# Altium schematic sheet ACT_REG.SchDoc
size A; SheetNumber: 5; SheetTotal: 5
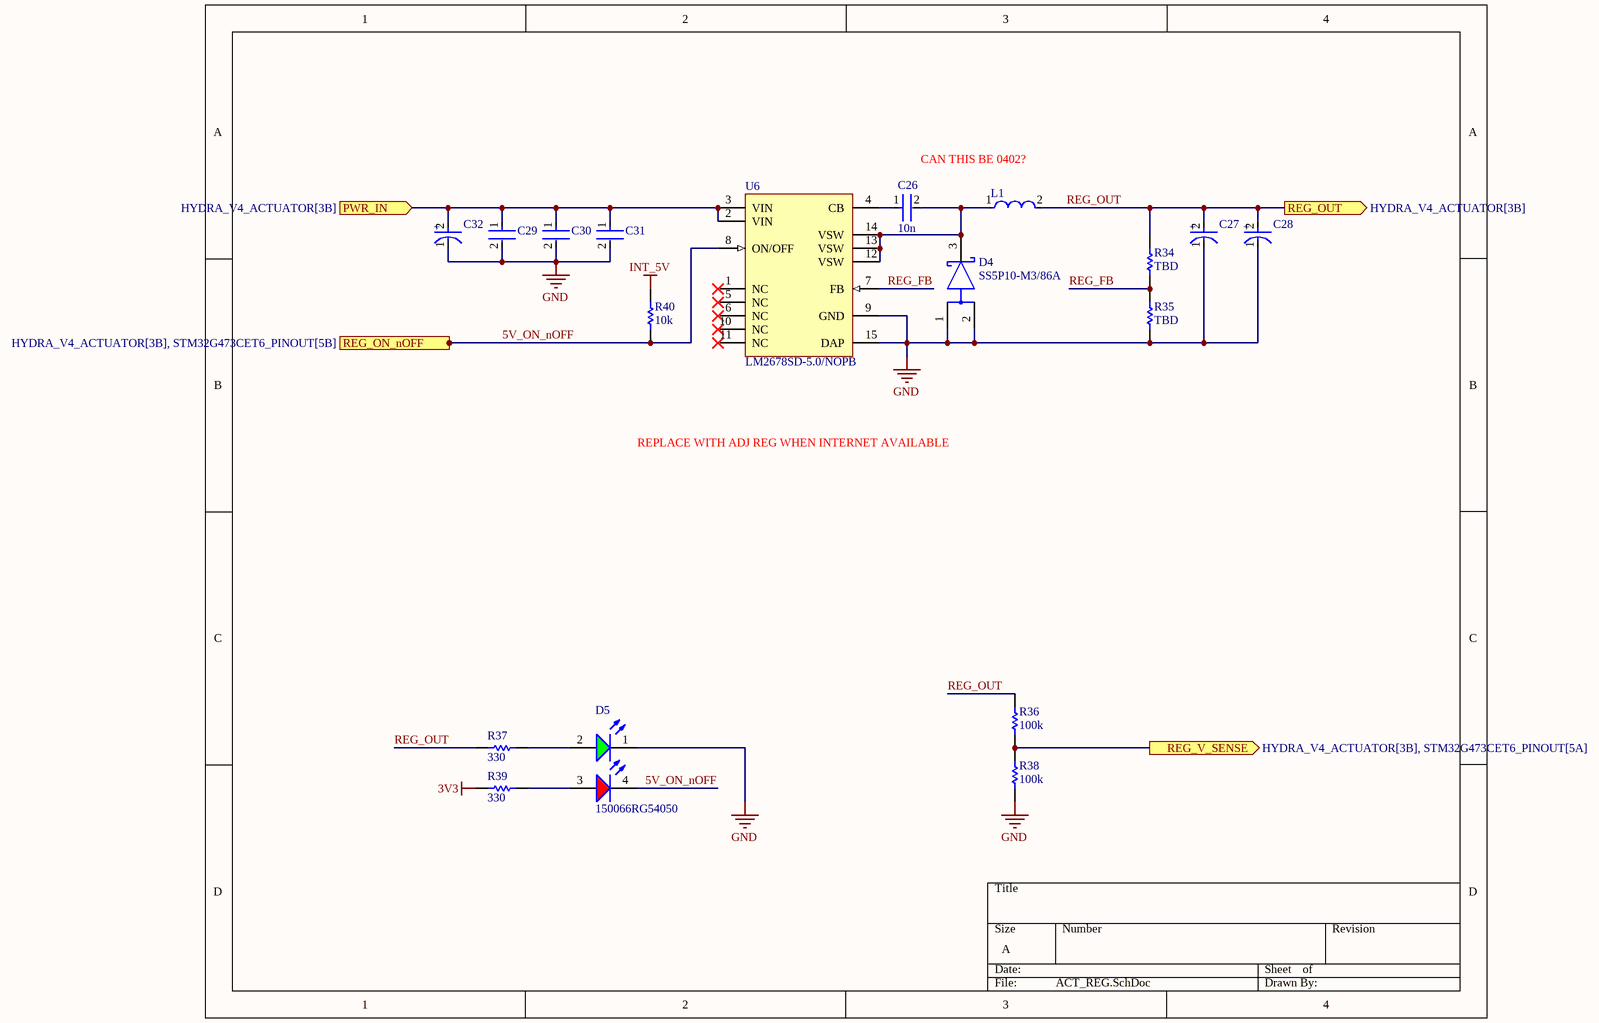
[diagram p0: ACT_REG.SchDoc]

## Parts
C26  10n  [FP-0402-L_1_0_0_05-W_0_5-IPC_A]
C27  10TPC68M  [FP-POSCAP-D2-MFG]  (value not drawn)
C28  10TPC68M  [FP-POSCAP-D2-MFG]  (value not drawn)
C29  C2012X5R1V156M125AC  [FP-C2012-125-0_2-MFG]  (value not drawn)
C30  C2012X5R1V156M125AC  [FP-C2012-125-0_2-MFG]  (value not drawn)
C31  C2012X5R1V156M125AC  [FP-C2012-125-0_2-MFG]  (value not drawn)
C32  10TPC68M  [FP-POSCAP-D2-MFG]  (value not drawn)
D4  SS5P10-M3/86A  [FP-95570-MFG]
D5  150066RG54050  [WL-SBCD_0606]
L1  IHLP4040DZER220M11  [FP-IHLP-4040DZ-FP_3_124x3-MFG]  (value not drawn)
R34  TBD  [R0603B]
R35  TBD  [R0603B]
R36  100k  [R0603B]
R37  330  [R0603B]
R38  100k  [R0603B]
R39  330  [R0603B]
R40  10k  [R0603B]
U6  LM2678SD-5.0/NOPB  [NHM0014A_V]

## Ports
PWR_IN (in, see HYDRA_V4_ACTUATOR[3B]), REG_ON_nOFF (in, see HYDRA_V4_ACTUATOR[3B], STM32G473CET6_PINOUT[5B]), REG_OUT (out, see HYDRA_V4_ACTUATOR[3B]), REG_V_SENSE (out, see HYDRA_V4_ACTUATOR[3B], STM32G473CET6_PINOUT[5A])

## Nets
3V3: R39.2
GND: C27.1(C) C28.1(C) C29.2 C30.2 C31.2 C32.1(C) D4.1(A) D4.2(A) D5.1(K) R35.1 R38.1 U6.9(GND) U6.15(DAP)
INT_5V: R40.2
5V_ON_nOFF: D5.4(K) R40.1 U6.8(ON/OFF) ; port REG_ON_nOFF
PWR_IN: C29.1 C30.1 C31.1 C32.2(A) U6.2(VIN) U6.3(VIN) ; port PWR_IN
REG_FB: R34.1 R35.2 U6.7(FB)
REG_OUT: C27.2(A) C28.2(A) L1.2 R34.2 R36.2 R37.2 ; port REG_OUT
REG_V_SENSE: R36.1 R38.2 ; port REG_V_SENSE
NetC26_1: C26.1 U6.4(CB)
NetC26_2: C26.2 D4.3(C) L1.1 U6.12(VSW) U6.13(VSW) U6.14(VSW)
NetD5_2: D5.2(A) R37.1
NetD5_3: D5.3(A) R39.1

Not connected (* = marked no-connect by the designer): U6 1(NC)* 5(NC)* 6(NC)* 10(NC)* 11(NC)*

## Notes on the sheet
- CAN THIS BE 0402?
- REPLACE WITH ADJ REG WHEN INTERNET AVAILABLE
- (in symbol CMP-05428-000598-1) +

## Library data of the parts
C26 = CMP-001-00058-1: LARGE PADS, 0402 CAP, CHANGE COMMENT TO MATCH REAL P/N; Capacitor Type: Ceramic; Min Operating Temperature: -55°C; Mounting Technology: Surface Mount; Pins: 2; Case/Package: 0402; RoHS Compliant: Yes; Max Operating Temperature: 85°C
C27 C28 C32 = CMP-05428-000598-1: Molded Tantalum Polymer Capacitor 68uF 20% 10V life 2000Hours SMD 2917; Dissipation Factor: 10%; ESR (Equivalent Series Resistance): 45mR; Leakage Current: 68uA; Polarity: Polar; Ripple Current: 1.7A; Material: Polymer; Voltage Rating: 10V; Voltage: 10V; Features: General Purpose; Width: 4.3mm; Packaging: Tape and Reel; Termination: SMD/SMT; Radiation Hardening: No; Construction: Flat; Height: 1.9mm; Height - Seated (Max): 0.079inch; Case Code (Metric): 7343; Length: 7.3mm; Case/Package: 2917; Depth: 4.3mm; Mount: Surface Mount; Capacitance: 68uF; Case Code (Imperial): 2917; Package Quantity: 3000; Tolerance: 20%; REACH SVHC: No SVHC; Series: POSCAP™ TPC; Lead Free: Lead Free; Min Operating Temperature: -55°C; RoHS Compliant: Yes; Voltage Rating (DC): 10V; Number of Pins: 2; Max Operating Temperature: 105°C
C29-C31 = CMP-08246-005496-1: Multilayer Ceramic Capacitors 15μF ±20% 35V X5R SMD 0805; Capacitance: 15uF; Mount: Surface Mount; Dielectric Material: Ceramic; Package Quantity: 2000; Termination: SMD/SMT; Height: 1.25mm; Min Operating Temperature: -55°C; Tolerance: 20%; Width: 0.049inch; Length: 0.079inch; Lead Free: Lead Free; Max Operating Temperature: 85°C; Voltage Rating: 35V; Case/Package: 0805; Packaging: Tape and Reel; RoHS Compliant: Yes; Case Code (Metric): 2012; Voltage Rating (DC): 35V; Dielectric: X5R; Thickness: 0.057inch; Case Code (Imperial): 0805; Resistor Type: Ceramic; Series: C
D4 = CMP-02539-000057-1: DIODE SCHOTTKY 100V 5A TO277A; Max Forward Surge Current (Ifsm): 150A; Element Configuration: Common Cathode; Max Reverse Leakage Current: 15uA; Forward Voltage: 880mV; Case/Package: TO-277A; Number of Pins: 3; Max Reverse Voltage (DC): 100V; Height: 0.031inch; Peak Non-Repetitive Surge Current: 150A; Series: eSMP®; Radiation Hardening: No; Length: 0.242inch; Max Repetitive Reverse Voltage (Vrrm): 100V; Forward Current: 5A; Width: 0.171inch; Min Operating Temperature: -55°C; Max Surge Current: 150A; Lead Free: Lead Free; RoHS Compliant: Yes; Average Rectified Current: 5A; Max Operating Temperature: 150°C; Max Reverse Current: 15uA; Package Quantity: 1500; Packaging: Tape and Reel; Mount: Surface Mount
D5 = CMP-004-00040-2: Led, Red/Grn, 180Mcd/230Mcd, 624Nm/525Nm Rohs Compliant: Yes; Source: rgled.SchLib; Component Type: Standard; Design Item ID: CMP-004-00034-2; Pins: 4
L1 = CMP-02424-000785-1: Commercial Inductors, Low DCR Series 22uH 5A 66mΩ 20%; Shielding: Shielded; Max DC Current: 4.5A; Test Frequency: 100kHz; DC Resistance (DCR): 66mR; Self Resonant Frequency: 1MHz; Core Material: Metal; Series: IHLP-4040DZ-11; Min Operating Temperature: -55°C; Rated Current-Max: 5A; Current Rating: 5A; Military Standard: Not; Depth: 10.3mm; Height - Seated (Max): 0.157inch; Contact Plating: Tin; Termination: SMD/SMT; Length: 0.43inch; Package Quantity: 1; Width: 0.405inch; Inductance Tolerance: 20%; Tolerance: 20%; Height: 4mm; RMS Current (Irms): 5A; Saturation Current: 4.5A; Inductance: 22uH; Mount: Surface Mount; Max Operating Temperature: 125°C; Case/Package: 4040; Packaging: Tape and Reel; Radiation Hardening: No; RoHS Compliant: Yes; Lead Free: Lead Free
R34-R40 = CMP-009-00002-14: Resistor
U6 = CMP-0069-01082-3: SIMPLE SWITCHER® High Efficiency 5A Step-Down Voltage Regulator, 14-pin LLP, Pb-Free; Manufacturer: Texas Instruments; PackageTopMarking: NS*UZXYTT*S0003DB; PowerWise: N; ComponentLink1Description: Datasheet URL; PackageReference: NHM0014A; PackageDescription: LLP, Plastic, Dual, 6 x 5 x 1mm Body, 14 Lead, 0.8mm Pitch, No Pullback; ComponentLink1URL: http://www.ti.com/general/docs/lit/getliterature.tsp?genericPartNumber=LM2678&fileType=pdf; RoHS: Y; PinCount: 14; CompType: Switcher